# EAGLE design motor_controller_sch (EAGLE 7.7.0)
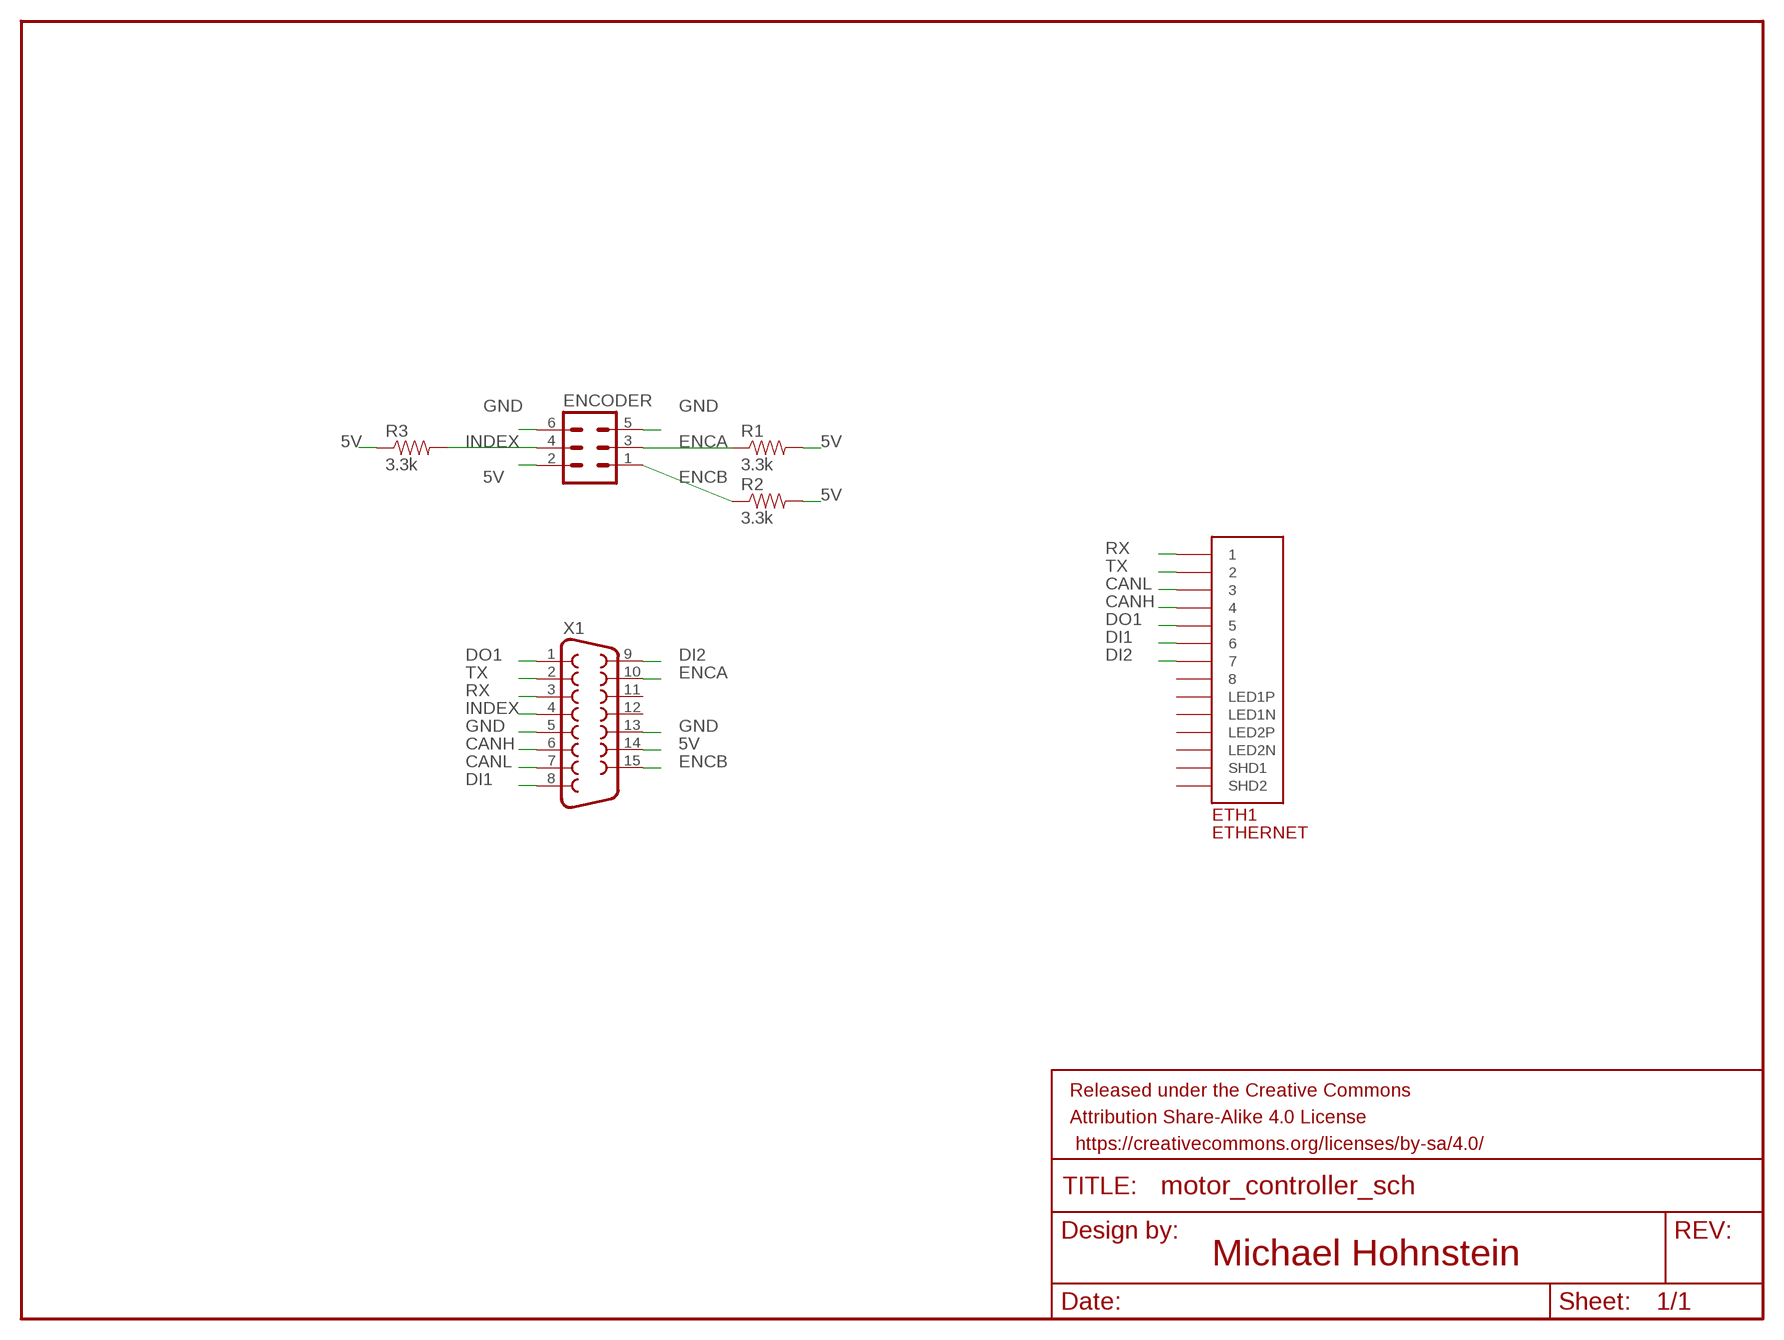
[diagram p0: schematic, sheet 1]

## Parts
ENCODER  06V  [06V]
ETH1  ETHERNET  [A122645-ND]
FRAME1  FRAME-LETTER  [CREATIVE_COMMONS]
R1  3.3k  RESISTOR0603  [0603-RES]
R2  3.3k  RESISTOR0603  [0603-RES]
R3  3.3k  RESISTOR0603  [0603-RES]
X1  F15HP  [F15HP]

## Nets
5V: ENCODER.2 R1.2 R2.2 R3.1 X1.14
CANH: ETH1.P$4 X1.6
CANL: ETH1.P$3 X1.7
DI1: ETH1.P$6 X1.8
DI2: ETH1.P$7 X1.9
DO1: ETH1.P$5 X1.1
ENCA: ENCODER.3 R1.1 X1.10
ENCB: ENCODER.1 R2.1 X1.15
GND: ENCODER.5 ENCODER.6 X1.5 X1.13
INDEX: ENCODER.4 R3.2 X1.4
RX: ETH1.P$1 X1.3
TX: ETH1.P$2 X1.2
Unconnected: ETH1.P$8 ETH1.P$9(LED1N) ETH1.P$10(LED1P) ETH1.P$11(LED2N) ETH1.P$12(LED2P) ETH1.P$13(SHD1) ETH1.P$14(SHD2) X1.11 X1.12

## Notes on the sheet
- Michael Hohnstein

## Library data of the parts
ENCODER = con-harting-v:06V: CONNECTOR; OC_FARNELL: unknown; OC_NEWARK: unknown
ETH1 = ETHERNET:ETHERNET: Ethernet port with 2 leds. digikey number A122645-ND
FRAME1 = SparkFun-Aesthetics:FRAME-LETTER: Schematic Frame Standard 8.5x11 US Letter frame
R1-R3 = SparkFun-Resistors:RESISTOR: Resistor Basic schematic elements and footprints for 0603, 1206, and PTH resistors.
X1 = con-subd:F15: SUB-D; OC_FARNELL: unknown; OC_NEWARK: unknown

## Board
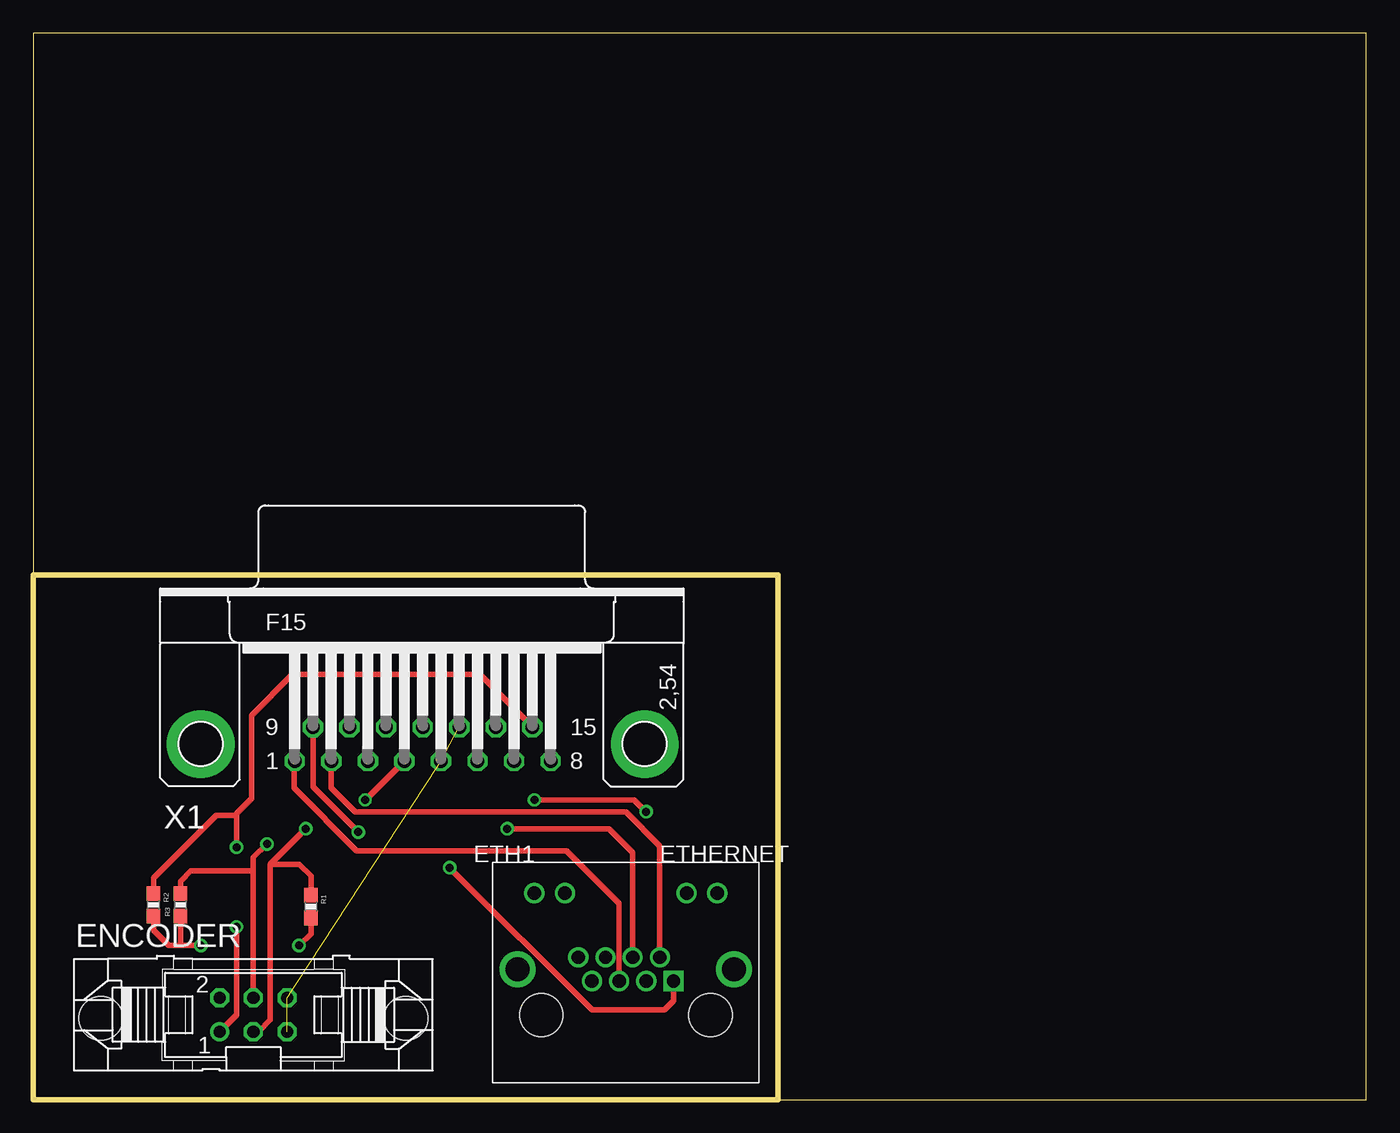
[diagram p1: board, top side]
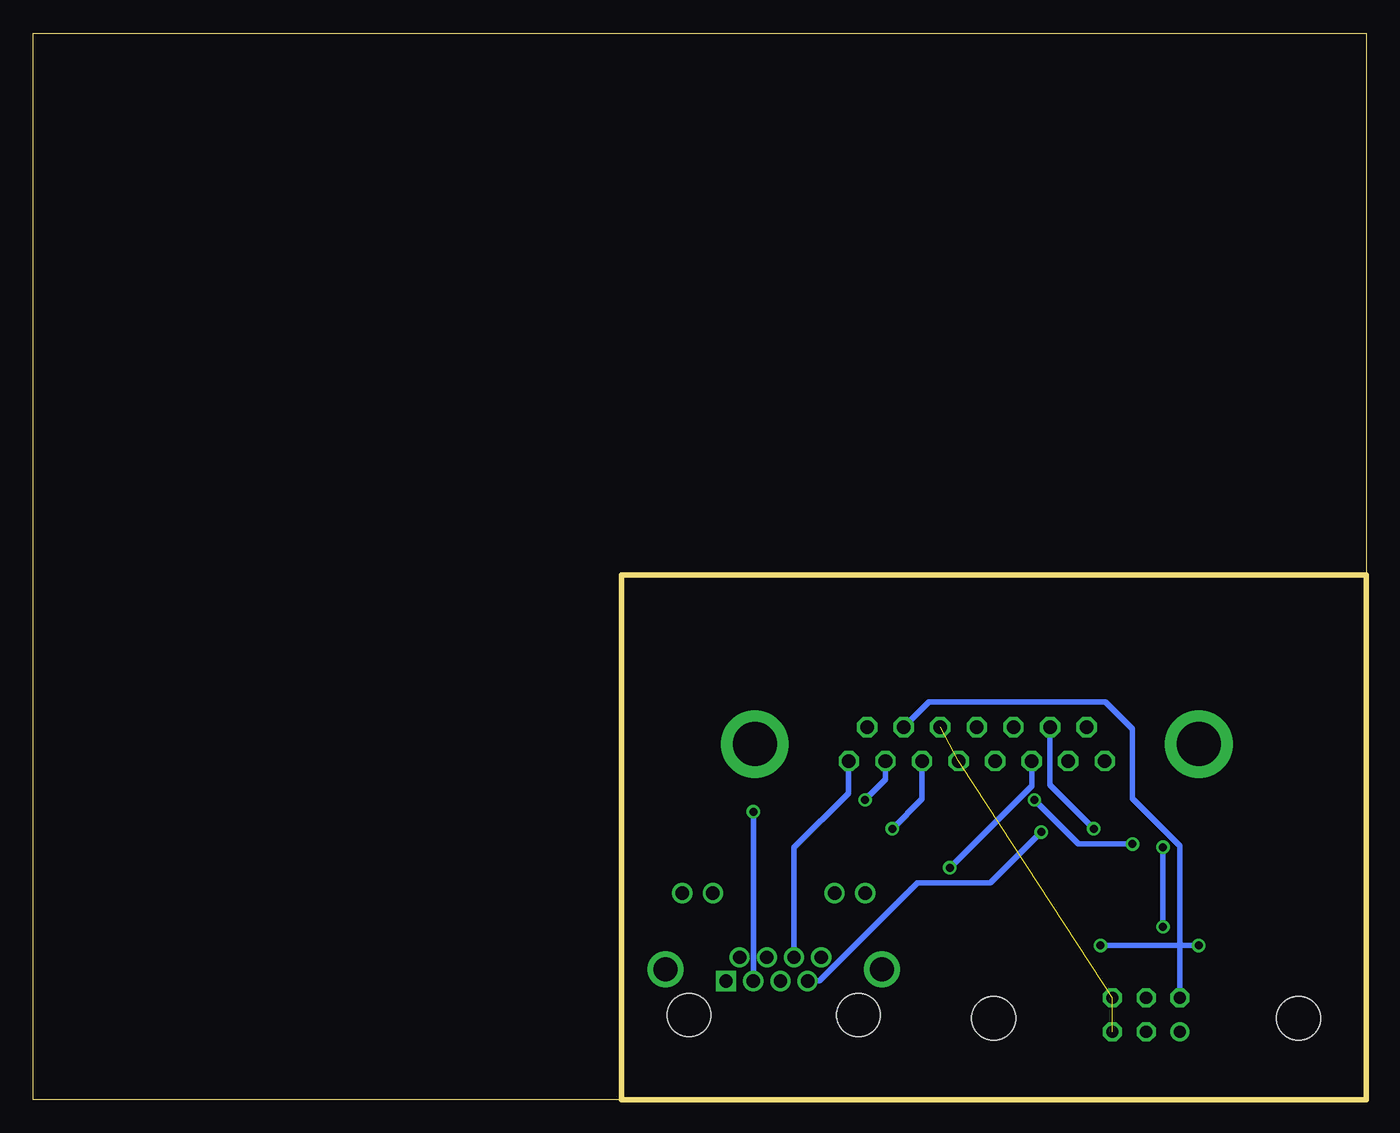
[diagram p2: board, bottom side, seen from below]

Size 100 x 80 mm. Coordinates in mm from the lower left corner, seen from the top.
Outline: 0,0 100,0 100,80 0,80 0,0
Outline: 0,0 55.88,0 55.88,39.37 0,39.37 0,0
Copper layers (1*16): Top 0.035mm / dielectric 1.5mm / Bottom 0.035mm
Design rules "default": minimum track width 10mil, minimum drill 24mil, track to track 8mil, track to pad 8mil, pad to pad 8mil, via to via 8mil, smd to smd 8mil, copper to edge 40mil, drill to drill 8mil, minimum pad ring 10mil, minimum via ring 8mil, stop-mask expansion 4mil, vias tented up to drill 0mil, thermal gap 10mil

### Footprints (pad centres in the part's own frame; a part is rotated, then mirrored left to right if it is on the bottom)
06V = drill 0.914: 1 -2.54,-1.27 | drill 0.914 octagon: 2 -2.54,1.27; 3 0,-1.27; 4 0,1.27; 5 2.54,-1.27; 6 2.54,1.27 | hole 3.302: 11.43,-0.254; -11.43,-0.254
A122645-ND = drill 1 square: P$1 3.58,2.54 | drill 1: P$2 2.56,4.32; P$3 1.54,2.54; P$4 0.52,4.32; P$5 -0.5,2.54; P$6 -1.52,4.32; P$7 -2.54,2.54; P$8 -3.56,4.32; P$9 -6.86,9.14; P$10 -4.57,9.14; P$11 4.57,9.14; P$12 6.86,9.14 | drill 1.8: P$13 -8.13,3.43; P$14 8.13,3.43 | hole 3.25: -6.35,0; 6.35,0
0603-RES = smd 1.1 x 1: 1 -0.85,0; 2 0.85,0
F15HP = drill 1.016 octagon: 1 -9.601,-1.27; 2 -6.858,-1.27; 3 -4.115,-1.27; 4 -1.372,-1.27; 5 1.372,-1.27; 6 4.115,-1.27; 7 6.858,-1.27; 8 9.601,-1.27; 9 -8.23,1.27; 10 -5.486,1.27; 11 -2.743,1.27; 12 0,1.27; 13 2.743,1.27; 14 5.486,1.27; 15 8.23,1.27 | drill 3.302 pad 5.08: G1 -16.662,0; G2 16.662,0

### Placement (x,y rotation side)
ENCODER  16.51,6.35 0 top
ETH1  44.45,6.35 0 top
R1  20.83,14.48 270 top
R2  9.02,14.61 270 top
R3  11.05,14.61 90 top
X1  29.21,26.67 0 top

### Tracks (layer width: path | path; a pad name or v marks a point on that pad's centre or on a via)
5V  (via drill 0.6)
  Top 0.406: R1.2 20.83,12.45 v19.94,11.56 | v12.57,11.56 11.05,11.56 | 11.05,11.56 10.16,11.56 9.02,12.7 R2.2 | R3.1 11.05,11.56
  Bottom 0.406: X1.14 32.79,29.84 19.56,29.84 17.53,27.81 17.53,22.61 13.97,19.05 13.97,11.56 | 13.97,11.56 ENCODER.2 | v19.94,11.56 13.97,11.56 | 13.97,11.56 v12.57,11.56
CANH  (via drill 0.6)
  Top 0.406: ETH1.P$4 44.97,18.53 43.18,20.32 v35.56,20.32
  Bottom 0.406: v35.56,20.32 33.33,22.55 X1.6
CANL  (via drill 0.6)
  Top 0.406: v45.97,21.59 45.09,22.48 v37.59,22.48
  Bottom 0.406: ETH1.P$3 45.97,8.91 v45.97,21.59 | v37.59,22.48 36.07,24 X1.7
DI1
  Bottom 0.406: ETH1.P$6 42.93,18.92 38.86,22.99 38.86,25.4 X1.8
DI2  (via drill 0.6)
  Top 0.406: v24.38,20.07 20.98,23.47 X1.9
  Bottom 0.406: ETH1.P$7 41.02,8.89 33.66,16.26 28.19,16.26 v24.38,20.07 | 20.95,27.91 X1.9
DO1
  Top 0.406: ETH1.P$5 43.95,14.72 40.01,18.67 24.26,18.67 19.56,23.37 19.56,25.4 X1.1
ENCA  (via drill 0.6)
  Top 0.406: v20.45,20.32 17.78,17.65 | 17.78,17.65 17.78,5.97 16.89,5.08 ENCODER.3 | 17.78,17.65 19.94,17.65 20.83,16.76 R1.1
  Bottom 0.406: X1.10 23.72,23.6 v20.45,20.32
ENCB  (via drill 0.6)
  Top 0.406: X1.15 33.5,31.88 19.43,31.88 16.38,28.83 16.38,22.61 15.24,21.46 15.24,21.34 | 14.22,5.08 ENCODER.1 15.24,6.35 v15.24,12.95 | 15.24,21.34 v15.24,18.92 | R2.1 9.02,16.64 13.72,21.34 15.24,21.34
  Bottom 0.406: v15.24,18.92 v15.24,12.95
GND  (3 unrouted)
INDEX  (via drill 0.6)
  Top 0.406: X1.4 24.92,22.48 v24.89,22.48 | v17.53,19.18 16.51,18.16 16.51,17.02 | 16.51,17.02 ENCODER.4 | R3.2 11.05,16.38 11.81,17.14 16.38,17.14 16.51,17.02
  Bottom 0.406: v24.89,22.48 21.59,19.18 v17.53,19.18
RX  (via drill 0.6)
  Top 0.406: ETH1.P$1 48.03,7.39 47.37,6.73 41.91,6.73 v31.24,17.4
  Bottom 0.406: v31.24,17.4 25.09,23.55 X1.3
TX
  Top 0.406: ETH1.P$2 46.99,10.67 46.99,19.05 44.45,21.59 24.13,21.59 22.35,23.37 X1.2